# Altium schematic sheet DA0-1_AD0-AD5.SchDoc
size A4; SheetNumber: 5; SheetTotal: 6
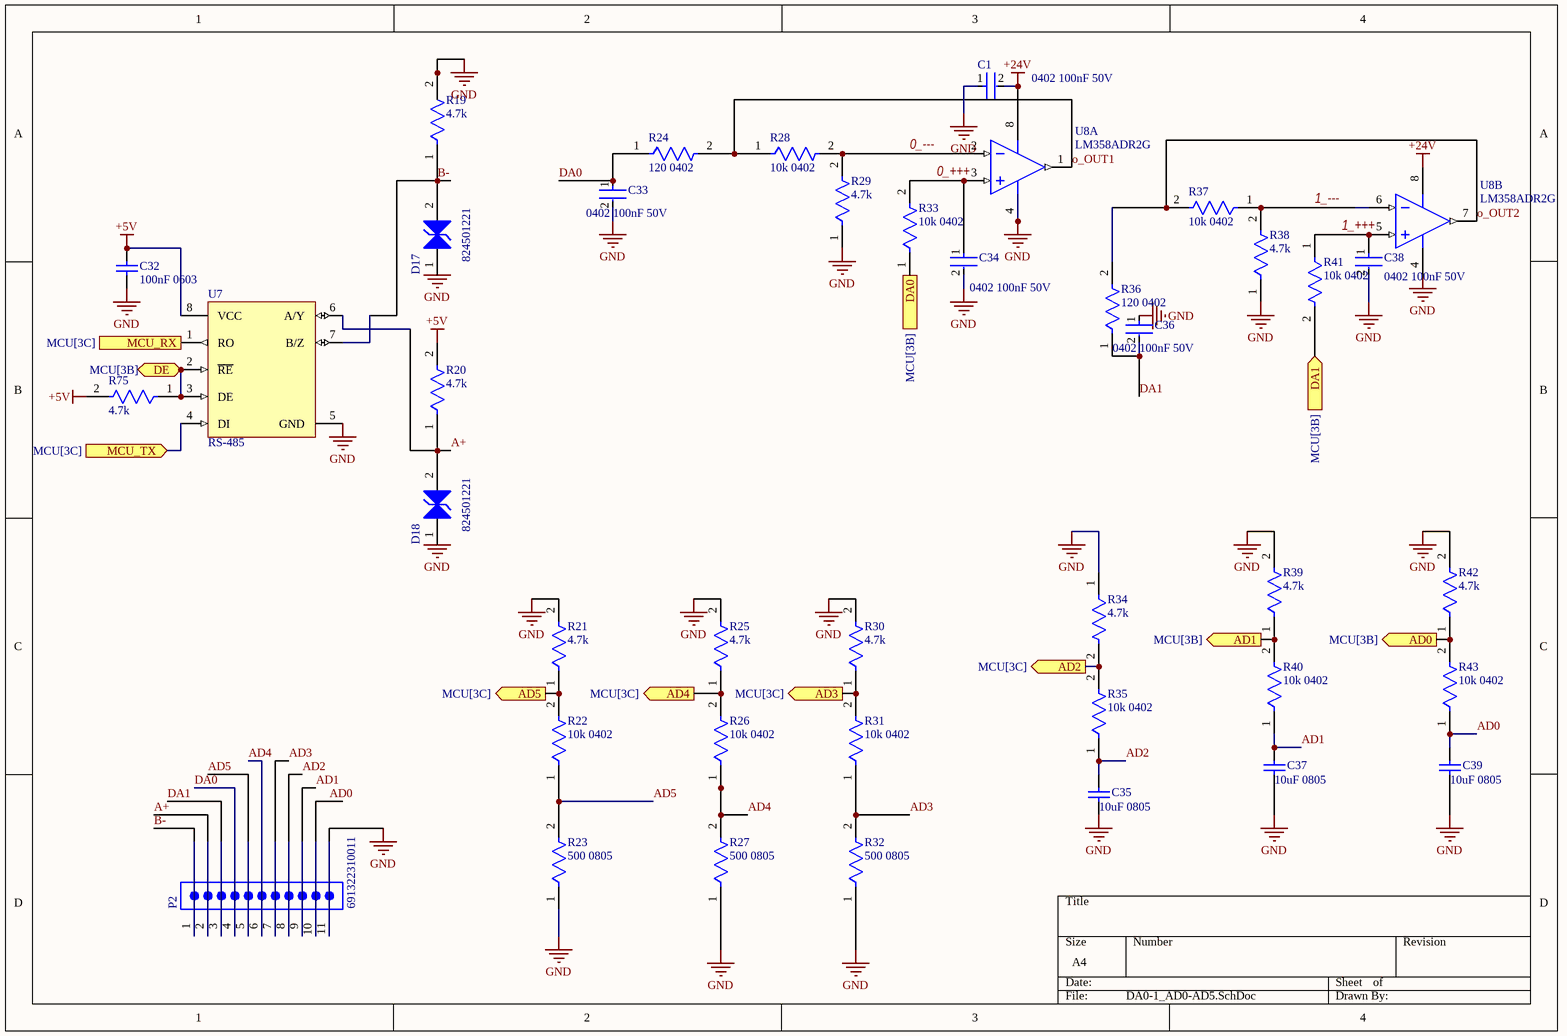
[diagram p0: DA0-1_AD0-AD5.SchDoc]

## Parts
C32  100nF 0603  [CAPC1608X90X35LL15T15]
C33  0402 100nF 50V  [FP-0402B104K500CT-IPC_C]
C34  0402 100nF 50V  [FP-0402B104K500CT-IPC_C]
C35  10uF 0805  [CAPC2013X145X50NL20T25]
C36  0402 100nF 50V  [FP-0402B104K500CT-IPC_C]
C37  10uF 0805  [CAPC2013X145X50NL20T25]
C38  0402 100nF 50V  [FP-0402B104K500CT-IPC_C]
C39  10uF 0805  [CAPC2013X145X50NL20T25]
D17  824501221  [WE-TVSP_DO-214AC_Bidirectional]
D18  824501221  [WE-TVSP_DO-214AC_Bidirectional]
P2  691322310011  [691322310011]
R19  4.7k  [FP-TFCR0402-IPC_A]
R20  4.7k  [FP-TFCR0402-IPC_A]
R21  4.7k  [FP-TFCR0402-IPC_A]
R22  10k 0402  [FP-CRGCQ0402-IPC_C]
R23  500 0805  [FP-RNCF0805-MFG]
R24  120 0402  [FP-RMCF0402-IPC_B]
R25  4.7k  [FP-TFCR0402-IPC_A]
R26  10k 0402  [FP-CRGCQ0402-IPC_C]
R27  500 0805  [FP-RNCF0805-MFG]
R28  10k 0402  [FP-TFCR0402-IPC_B]
R29  4.7k  [FP-TFCR0402-IPC_A]
R30  4.7k  [FP-TFCR0402-IPC_A]
R31  10k 0402  [FP-CRGCQ0402-IPC_C]
R32  500 0805  [FP-RNCF0805-MFG]
R33  10k 0402  [FP-TFCR0402-IPC_B]
R34  4.7k  [FP-TFCR0402-IPC_A]
R35  10k 0402  [FP-CRGCQ0402-IPC_C]
R36  120 0402  [FP-RMCF0402-IPC_B]
R37  10k 0402  [FP-TFCR0402-IPC_B]
R38  4.7k  [FP-TFCR0402-IPC_A]
R39  4.7k  [FP-TFCR0402-IPC_A]
R40  10k 0402  [FP-CRGCQ0402-IPC_C]
R41  10k 0402  [FP-TFCR0402-IPC_B]
R42  4.7k  [FP-TFCR0402-IPC_A]
R43  10k 0402  [FP-CRGCQ0402-IPC_C]
R75  4.7k  [FP-TFCR0402-IPC_A]
U7  RS-485  [SOIC127P600X175-8_M8_15_M]
U8  LM358ADR2G  [ONSC-SOIC-8-751-07_V]  (parts A,B of 2)
С1  0402 100nF 50V  [FP-0402B104K500CT-IPC_C]

## Ports
AD0 (out, see MCU[3B]), AD1 (out, see MCU[3B]), AD2 (out, see MCU[3C]), AD3 (out, see MCU[3C]), AD4 (out, see MCU[3C]), AD5 (out, see MCU[3C]), DA0 (in, see MCU[3B]), DA1 (in, see MCU[3B]), DE (bidir, see MCU[3B]), MCU_RX (out, see MCU[3C]), MCU_TX (in, see MCU[3C])

## Nets
+5V: C32.1 R20.2 R75.2 U7.8(VCC)
+24V: U8.8(VCC) С1.2
GND: C32.2 C33.2 C34.2 C35.1 C36.1 C37.1 C38.2 C39.1 D17.1 D18.1 P2.11 R19.2 R21.2 R23.1 R25.2 R27.1 R29.1 R30.2 R32.1 R34.1 R38.1 R39.2 R42.2 U7.5(GND) U8.4(VEE/GND) С1.1
0_+++: C34.1 R33.2 U8.3(INA+)
0_---: R28.2 R29.2 U8.2(INA-)
1_+++: C38.1 R41.1 U8.5(INB+)
1_---: R37.1 R38.2 U8.6(INB-)
A+: D18.2 P2.2 R20.1 U7.6(A/Y)
AD0: C39.2 P2.10 R43.1
AD0: R42.1 R43.2 ; port AD0  [a separate net that carries the same name]
AD1: C37.2 P2.9 R40.1
AD1: R39.1 R40.2 ; port AD1  [a separate net that carries the same name]
AD2: C35.2 P2.8 R35.1
AD2: R34.2 R35.2 ; port AD2  [a separate net that carries the same name]
AD3: R30.1 R31.2 ; port AD3
AD3: P2.7 R31.1 R32.2  [a separate net that carries the same name]
AD4: R25.1 R26.2 ; port AD4
AD4: P2.6 R26.1 R27.2  [a separate net that carries the same name]
AD5: R21.1 R22.2 ; port AD5
AD5: P2.5 R22.1 R23.2  [a separate net that carries the same name]
B-: D17.2 P2.1 R19.1 U7.7(B/Z)
DA0: C33.1 P2.4 R24.1
DA0: R33.1 ; port DA0  [a separate net that carries the same name]
DA1: C36.2 P2.3 R36.1
DA1: R41.2 ; port DA1  [a separate net that carries the same name]
DE: R75.1 U7.2(~{RE}) U7.3(DE) ; port DE
MCU_RX: U7.1(RO) ; port MCU_RX
MCU_TX: U7.4(DI) ; port MCU_TX
o_OUT1: R24.2 R28.1 U8.1(OUTA)
o_OUT2: R36.2 R37.2 U8.7(OUTB)

## Library data of the parts
C32 = CMP-2006-04391-1: Manufacturer: AVX Interconnect / Elco; Part Number: 06035C104KAZ2A
C33 C34 C36 C38 С1 = CMP-45632-000010-1: CAP CER 0.1UF 50V X7R 0402; Tolerance: 10%; Max Operating Temperature: 125°C; Case Code (Metric): 1005; RoHS Compliant: Yes; Series: -; Case Code (Imperial): 0402; Voltage Rating: 50V; Min Operating Temperature: -55°C; Mount: Surface Mount; Capacitance: 100nF; Case/Package: 0402; Packaging: Cut Tape
C35 C37 C39 = CMP-2007-01019-1: Manufacturer: Kemet; Part Number: C0805C106M8PACTU
D17 D18 = CMP-03913-71101551-2: TVS diode [Würth Elektronik] 824501221 TVS diode; Min Breakdown Voltage: 25.65V; Clamping Voltage: 35.5V; Number of Bidirectional Channels: 1; Peak Pulse Current: 11.3A; Reverse Standoff Voltage: 22V; Leakage Current: 1µA; Peak Pulse Power: 400W; Power Line Protection: No; Polarity: Bidirectional; Max Operating Temperature: 150°C; Breakdown Voltage: 25.65V; Packaging: Cut Tape; Length: 4.24mm; Width: 2.67mm; RoHS: Compliant; Min Operating Temperature: -65°C; Max Breakdown Voltage: 25.65V; Composition: Zener; REACH SVHC: Unknown; Height: 2.25mm; Number of Pins: 2; Mount: Surface Mount
P2 = CMP-1502-01895-3: Terminal Block, 3.81MM Pitch, Horizontal Pcb Header, 300VAC, 11 Pins
R19-R21 R25 R29 R30 R34 R38 R39 R42 R75 = CMP-250906-194630-1: RES Thin Film,  4.7kΩ, 0.5%, 0.063W, 25ppm/°C, 0402
R22 R26 R31 R35 R40 R43 = CMP-03211-008081-1: CRGCQ 0402 10K 5%; Manufacturer: TE Connectivity; Manufacturer Part Number: CRGCQ0402J10K; Power Rating: 0.0625W; Tolerance: 0.05; Voltage Rating: 50V; Temperature Coefficient: ±100ppm/°C; Resistance: 10KΩ; Value: 10KΩ; RoHS: TRUE; Octopart: https://octopart.com/crgcq0402j10k-te+connectivity-91017993; ComponentLink2URL: https://www.te.com/commerce/DocumentDelivery/DDEController?Action=showdoc&DocId=Data+Sheet%7F1773204-3%7F1%7Fpdf%7FEnglish%7FENG_DS_1773204-3_1.pdf%7F4-2176347-923; Package: CRGCQ0402; Mouser Description: Res Thick Film 0402 10K Ohm 5% 0.063W(1/16W) ±100ppm/C Pad SMD Automotive T/R; Temperature Range High: +155°C; Composition: Thick Film; Automotive: Yes; Category: Res; Temperature Range Low: -55°C; Height: 0.4mm; Device Class L3: Chip SMD Resistors; Device Class L2: Resistors; Digikey Description: CRGCQ 0402 10K 5%; Ambient Temperature Range High: +70°C; Device Class L1: Passive Components; Lead Free: Yes; ComponentLink2Description: Datasheet; Temperature: -55°C to +155°C; Series: CRGCQ; Ipc Land Pattern Name: RESC10050X35
R23 R27 R32 = CMP-00347-25743669-1: RNCF0805TKY500R RNCF Precision Thin Film Chip Resistor 0805 Size 500 Ohm 0.01% 0.125 W 5 ppm/°C 2-Pin SMD T/R; Voltage Rating: 150V; Power Rating: 125mW; Resistance: 500Ω; Max Operating Temperature: 155°C; Composition: Thin Film; Min Operating Temperature: -55°C; Temperature Coefficient: 5ppm/°C; Case/Package: 0805; NexarPartId: 25743669; Mount: Surface Mount; Height: 650µm; Tolerance: 0.01%; RoHS: Non-Compliant
R24 R36 = CMP-26527-003696-1: 120Ω ±1% 0.063W 0402 Thick Film Chip Resistor AEC-Q200 compliant; Max Power Dissipation: 63mW; Resistance: 120R; Temperature Coefficient: 100ppm/°C; RoHS Compliant: Yes; Height: 0.016inch; Radiation Hardening: No; Case Code (Imperial): 0402; Case/Package: 0402; Min Operating Temperature: -55°C; Mount: Surface Mount; Contact Plating: Tin; Resistor Type: Thick Film; Tolerance: 1%; Case Code (Metric): 1005; Number of Terminations: 2; Max Operating Temperature: 155°C; Width: 0.02inch; Series: RMCF; Length: 0.039inch; Package Quantity: 10000; Packaging: Tape and Reel; Features: Automotive AEC-Q200
R28 R33 R37 R41 = CMP-250906-284563-1: RES Thin Film,  10kΩ, 0.1%, 0.063W, 25ppm/°C, 0402; RoHS Compliant: Yes
U7 = CMP-00572-88282978-3: Single Transmitter/Receiver RS-422/RS-485 8-Pin SOIC N T/R; Manufacturer Lifecycle Status: ACTIVE; Number of Transmitters: 1; RAM Size: 48kB; Data Rate: 115kbps; Simplex/Duplex: Half Duplex; Operating Supply Voltage: 5V; Interface: RS-422, RS-485; Min Supply Voltage: 4.5V; ESD Protection: Yes; Pitch: 1.3mm; Max Supply Voltage: 5.5V; Logic Function: Transceiver; Max Junction Temperature (Tj): 150°C; Export Control Classification Number (ECCN) Code: EAR99; Width: 3.9mm; Number of Receivers: 1; Min Operating Temperature: -40°C; Lifecycle Status: Production; Mount: Surface Mount; Height: 0m; Case/Package: SOIC; ComponentLink2URL: https://octopart.com/cad-content/api/get-model-datasheet/15189/88282978; RoHS: Compliant; HelpURL: https://octopart.com/cad-content/api/get-model-datasheet/15189/88282978; ComponentLink2Description: Datasheet URL; ComponentLink1URL: http://www.renesas.com; Number of Pins: 8; Length: 4.9mm; ComponentLink1Description: Manufacturer's Website; Number of Drivers: 1; ComponentLink3Description: Manufacturer's Package Drawing; Max Operating Temperature: 85°C; ComponentLink3URL: https://www.renesas.com/en/document/psc/m815-8-lead-narrow-body-small-outline-plastic-package
U8 = CMP-1310-00289-1: Single Supply Dual Operational Amplifier, 3 to 32 V, 0 to 70 degC, 8-Pin SOIC, Pb-Free, Tape and Reel; Manufacturer: On Semiconductor; VCC Min (V): 3; VCC Max (V): 32; DatasheetVersion: Rev. 27; ComponentLink1URL: http://www.onsemi.com/; PackageVersion: Rev. AK, 02/2011; Packing: Tape and Reel; ComponentLink3URL: http://www.onsemi.com/pub_link/Collateral/751-07.PDF; ComponentLink2URL: http://www.onsemi.cn/pub_link/Collateral/LM358-D.PDF; Mounting Technology: Surface Mount; PackageReference: SOIC-8-751-07; PackageDescription: 8-Pin Small Outline Integrated Circuit, Body 4.9 x 3.9 mm, Pitch 1.27 mm; ComponentLink3Description: Package Specification; ComponentLink2Description: Datasheet; RoHS: TRUE; ComponentLink1Description: Manufacturer URL; PartNumber: LM358ADR2G